# EAGLE design Switch Decoderv06 (EAGLE 8.4.3)
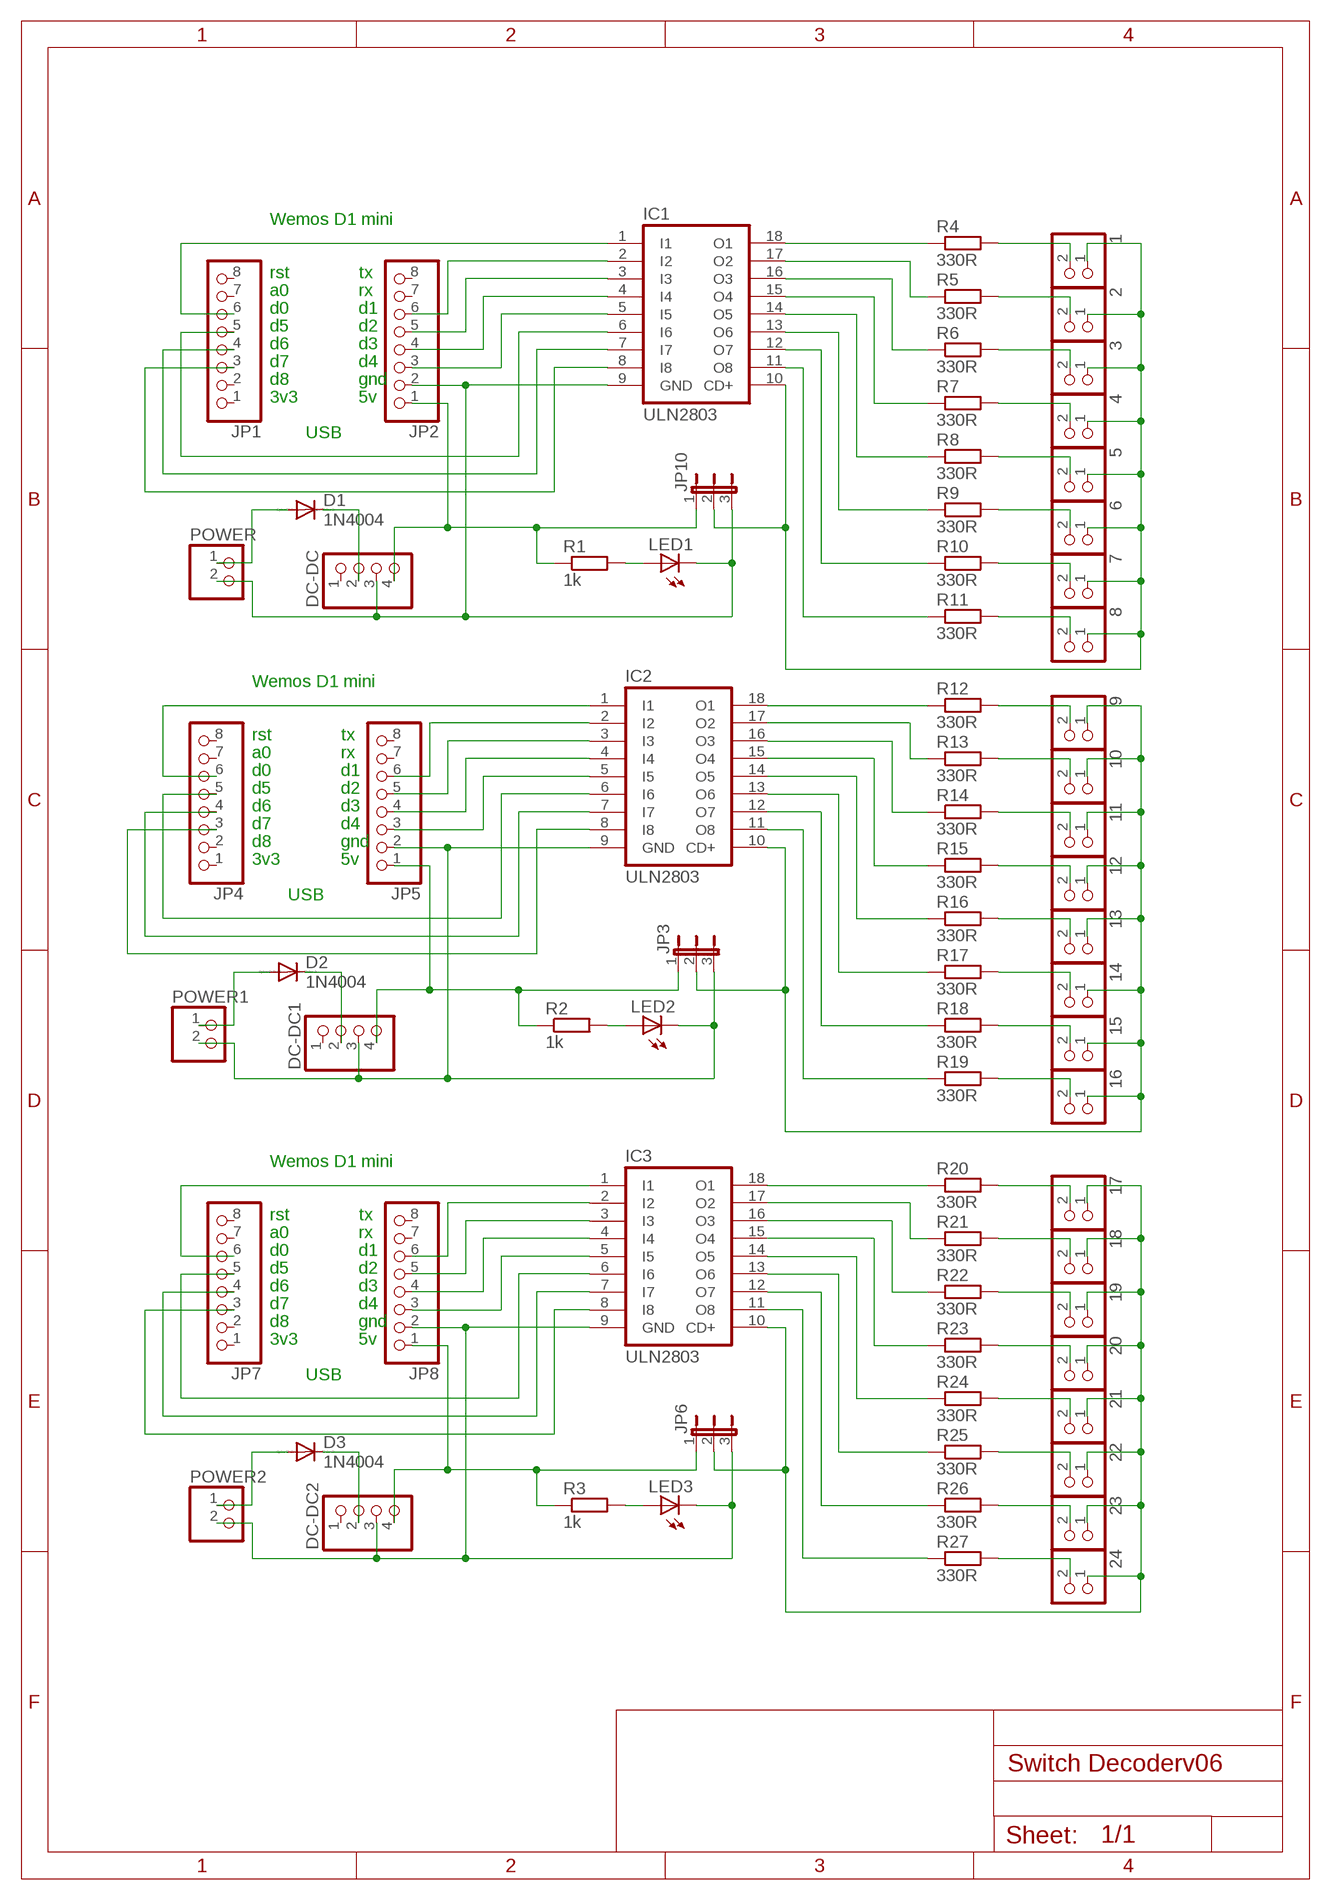
[diagram p0: schematic, sheet 1]

## Parts
1  PINHD-1X2  [1X02]
2  PINHD-1X2  [1X02]
3  PINHD-1X2  [1X02]
4  PINHD-1X2  [1X02]
5  PINHD-1X2  [1X02]
6  PINHD-1X2  [1X02]
7  PINHD-1X2  [1X02]
8  PINHD-1X2  [1X02]
9  PINHD-1X2  [1X02]
10  PINHD-1X2  [1X02]
11  PINHD-1X2  [1X02]
12  PINHD-1X2  [1X02]
13  PINHD-1X2  [1X02]
14  PINHD-1X2  [1X02]
15  PINHD-1X2  [1X02]
16  PINHD-1X2  [1X02]
17  PINHD-1X2  [1X02]
18  PINHD-1X2  [1X02]
19  PINHD-1X2  [1X02]
20  PINHD-1X2  [1X02]
21  PINHD-1X2  [1X02]
22  PINHD-1X2  [1X02]
23  PINHD-1X2  [1X02]
24  PINHD-1X2  [1X02]
D1  1N4004  [DO41-10]
D2  1N4004  [DO41-10]
D3  1N4004  [DO41-10]
DC-DC  PINHD-1X4  [1X04]
DC-DC1  PINHD-1X4  [1X04]
DC-DC2  PINHD-1X4  [1X04]
IC1  ULN2803  ULN2803A  [DIL18]
IC2  ULN2803  ULN2803A  [DIL18]
IC3  ULN2803  ULN2803A  [DIL18]
JP1  PINHD-1X8  [1X08]
JP2  PINHD-1X8  [1X08]
JP3  JP2E  [JP2]
JP4  PINHD-1X8  [1X08]
JP5  PINHD-1X8  [1X08]
JP6  JP2E  [JP2]
JP7  PINHD-1X8  [1X08]
JP8  PINHD-1X8  [1X08]
JP10  JP2E  [JP2]
LED1  LED3MM  [LED3MM]
LED2  LED3MM  [LED3MM]
LED3  LED3MM  [LED3MM]
POWER  PINHD-1X2  [1X02]
POWER1  PINHD-1X2  [1X02]
POWER2  PINHD-1X2  [1X02]
R1  1k  R-EU_0309/10  [0309/10]
R2  1k  R-EU_0309/10  [0309/10]
R3  1k  R-EU_0309/10  [0309/10]
R4  330R  R-EU_0207/7  [0207/7]
R5  330R  R-EU_0207/7  [0207/7]
R6  330R  R-EU_0207/7  [0207/7]
R7  330R  R-EU_0207/7  [0207/7]
R8  330R  R-EU_0207/7  [0207/7]
R9  330R  R-EU_0207/7  [0207/7]
R10  330R  R-EU_0207/7  [0207/7]
R11  330R  R-EU_0207/7  [0207/7]
R12  330R  R-EU_0207/7  [0207/7]
R13  330R  R-EU_0207/7  [0207/7]
R14  330R  R-EU_0207/7  [0207/7]
R15  330R  R-EU_0207/7  [0207/7]
R16  330R  R-EU_0207/7  [0207/7]
R17  330R  R-EU_0207/7  [0207/7]
R18  330R  R-EU_0207/7  [0207/7]
R19  330R  R-EU_0207/7  [0207/7]
R20  330R  R-EU_0207/7  [0207/7]
R21  330R  R-EU_0207/7  [0207/7]
R22  330R  R-EU_0207/7  [0207/7]
R23  330R  R-EU_0207/7  [0207/7]
R24  330R  R-EU_0207/7  [0207/7]
R25  330R  R-EU_0207/7  [0207/7]
R26  330R  R-EU_0207/7  [0207/7]
R27  330R  R-EU_0207/7  [0207/7]

## Nets
N$1 [Gnd]: DC-DC.3 IC1.9(GND) JP2.2 JP10.3 LED1.K(C) POWER.2
N$2: IC1.1(I1) JP1.6
N$3: IC1.7(I7) JP1.4
N$4 [5V]: D1.C DC-DC.2
N$5: IC1.6(I6) JP1.5
N$6: LED1.A R1.2
N$7: IC1.3(I3) JP2.5
N$8 [5V]: 1.1 2.1 3.1 4.1 5.1 6.1 7.1 8.1 IC1.10(CD+) JP10.2
N$9: IC1.5(I5) JP2.3
N$10: IC1.2(I2) JP2.6
N$11: IC1.8(I8) JP1.3
N$12: IC1.18(O1) R4.1
N$13: IC1.4(I4) JP2.4
N$14: IC2.1(I1) JP4.6
N$15 [Gnd]: 1.2 R4.2
N$16 [5V]: 9.1 10.1 11.1 12.1 13.1 14.1 15.1 16.1 IC2.10(CD+) JP3.2
N$17 [Gnd]: IC1.17(O2) R5.1
N$18 [Gnd]: 2.2 R5.2
N$19 [Gnd]: 3.2 R6.2
N$20 [Gnd]: IC1.16(O3) R6.1
N$21 [Gnd]: IC1.15(O4) R7.1
N$22 [Gnd]: 4.2 R7.2
N$23 [Gnd]: 5.2 R8.2
N$24 [Gnd]: IC1.14(O5) R8.1
N$25 [Gnd]: IC1.13(O6) R9.1
N$26 [Gnd]: 6.2 R9.2
N$27 [Gnd]: 7.2 R10.2
N$28 [Gnd]: IC1.12(O7) R10.1
N$29 [Gnd]: 8.2 R11.2
N$30: LED2.A R2.2
N$31: IC2.2(I2) JP5.6
N$32: IC2.3(I3) JP5.5
N$33: IC2.4(I4) JP5.4
N$34 [5V]: D2.A POWER1.1
N$35 [5V]: D2.C DC-DC1.2
N$36: IC2.5(I5) JP5.3
N$37: IC2.6(I6) JP4.5
N$38: IC2.7(I7) JP4.4
N$39: IC2.8(I8) JP4.3
N$40: IC3.18(O1) R20.1
N$41 [Gnd]: DC-DC1.3 IC2.9(GND) JP3.3 JP5.2 LED2.K(C) POWER1.2
N$42: IC1.11(O8) R11.1
N$43 [Gnd]: IC2.11(O8) R19.1
N$44: IC2.18(O1) R12.1
N$45 [Gnd]: IC2.17(O2) R13.1
N$46 [Gnd]: 9.2 R12.2
N$47 [5V]: D1.A POWER.1
N$48 [Gnd]: 10.2 R13.2
N$49 [Gnd]: IC2.16(O3) R14.1
N$50 [Gnd]: IC2.15(O4) R15.1
N$51 [Gnd]: 11.2 R14.2
N$52 [Gnd]: 12.2 R15.2
N$53 [Gnd]: IC2.14(O5) R16.1
N$54 [Gnd]: IC2.13(O6) R17.1
N$55 [Gnd]: 13.2 R16.2
N$56 [Gnd]: 14.2 R17.2
N$57 [Gnd]: IC2.12(O7) R18.1
N$58 [Gnd]: 15.2 R18.2
N$59: IC3.1(I1) JP7.6
N$60: LED3.A R3.2
N$61: IC3.2(I2) JP8.6
N$62: IC3.3(I3) JP8.5
N$63: IC3.4(I4) JP8.4
N$64 [5V]: D3.A POWER2.1
N$65 [5V]: D3.C DC-DC2.2
N$66: IC3.5(I5) JP8.3
N$67: IC3.6(I6) JP7.5
N$68: IC3.7(I7) JP7.4
N$69: IC3.8(I8) JP7.3
N$70 [5V]: 17.1 18.1 19.1 20.1 21.1 22.1 23.1 24.1 IC3.10(CD+) JP6.2
N$71 [Gnd]: DC-DC2.3 IC3.9(GND) JP6.3 JP8.2 LED3.K(C) POWER2.2
N$72 [Gnd]: 16.2 R19.2
N$73 [Gnd]: IC3.11(O8) R27.1
N$74 [5V]: DC-DC.4 JP2.1 JP10.1 R1.1
N$75 [Gnd]: IC3.17(O2) R21.1
N$76 [5V]: DC-DC1.4 JP3.1 JP5.1 R2.1
N$77 [5V]: DC-DC2.4 JP6.1 JP8.1 R3.1
N$78 [Gnd]: IC3.16(O3) R22.1
N$79 [Gnd]: IC3.15(O4) R23.1
N$81 [Gnd]: 17.2 R20.2
N$82 [Gnd]: IC3.14(O5) R24.1
N$83 [Gnd]: IC3.13(O6) R25.1
N$84 [Gnd]: 18.2 R21.2
N$85 [Gnd]: 19.2 R22.2
N$86 [Gnd]: IC3.12(O7) R26.1
N$87 [Gnd]: 20.2 R23.2
N$88 [Gnd]: 21.2 R24.2
N$89 [Gnd]: 22.2 R25.2
N$90 [extra]: 23.2 R26.2
N$91 [Gnd]: 24.2 R27.2
Unconnected: DC-DC1.1 DC-DC2.1 DC-DC.1 JP1.1 JP1.2 JP1.7 JP1.8 JP2.7 JP2.8 JP4.1 JP4.2 JP4.7 JP4.8 JP5.7 JP5.8 JP7.1 JP7.2 JP7.7 JP7.8 JP8.7 JP8.8

## Notes on the sheet
- Wemos D1 mini
- rst | tx
- a0 | rx
- d0 | d1
- d5 | d2
- d6 | d3
- d7 | d4
- d8 | gnd
- 3v3 | 5v
- USB
- Wemos D1 mini
- rst | tx
- a0 | rx
- d0 | d1
- d5 | d2
- d6 | d3
- d7 | d4
- d8 | gnd
- 3v3 | 5v
- USB
- Wemos D1 mini
- rst | tx
- a0 | rx
- d0 | d1
- d5 | d2
- d6 | d3
- d7 | d4
- d8 | gnd
- 3v3 | 5v
- USB

## Library data of the parts
1-24 POWER POWER1 POWER2 = pinhead:PINHD-1X2: PIN HEADER
D1-D3 = diode:1N4004: DIODE general purpose rectifier, 1 A
DC-DC DC-DC1 DC-DC2 = pinhead:PINHD-1X4: PIN HEADER
IC1-IC3 = uln-udn:ULN2803A: DRIVER ARRAY
JP1 JP2 JP4 JP5 JP7 JP8 = pinhead:PINHD-1X8: PIN HEADER
JP3 JP6 JP10 = jumper:JP2E: JUMPER
LED1-LED3 = led:LED: LED OSRAM: - CHIPLED LG R971, LG N971, LY N971, LG Q971, LY Q971, LO R971, LY R971 LH N974, LH R974 LS Q976, LO Q976, LY Q976 LO Q996 - Hyper CHIPLED LW Q18S LB Q993, LB Q99A, LB R99A - SideLED LS A670, LO A670, LY A670, LG A670, LP A670 LB A673, LV A673, LT A673, LW A673 LH A674 LY A675 LS A676, LA A676, LO A676, LY A676, LW A676 LS A679, LY A679, LG A679 - Hyper Micro SIDELED® LS Y876, LA Y876, LO Y876, LY Y876 LT Y87S - SmartLED LW L88C, LW L88S LB L89C, LB L89S, LG L890 LS L89K, LO L89K, LY L89K LS L896, LA L896, LO L896, LY L896 - TOPLED LS T670, LO T670, LY T670, LG T670, LP T670 LSG T670, LSP T670, LSY T670, LOP T670, LYG T670 LG T671, LOG T671, LSG T671 LB T673, LV T673, LT T673, LW T673 LH T674 LS T676, LA T676, LO T676, LY T676, LB T676, LH T676, LSB T676, LW T676 LB T67C, LV T67C, LT T67C, LS T67K, LO T67K, LY T67K, LW E67C LS E67B, LA E67B, LO E67B, LY E67B, LB E67C, LV E67C, LT E67C LW T67C LS T679, LY T679, LG T679 LS T770, LO T770, LY T770, LG T770, LP T770 LB T773, LV T773, LT T773, LW T773 LH T774 LS E675, LA E675, LY E675, LS T675 LS T776, LA T776, LO T776, LY T776, LB T776 LHGB T686 LT T68C, LB T68C - Hyper Mini TOPLED® LB M676 - Mini TOPLED Santana® LG M470 LS M47K, LO M47K, LY M47K Source: http://www.osram.convergy.de LUXEON: - LUMILED® LXK2-PW12-R00, LXK2-PW12-S00, LXK2-PW14-U00, LXK2-PW14-V00 LXK2-PM12-R00, LXK2-PM12-S00, LXK2-PM14-U00 LXK2-PE12-Q00, LXK2-PE12-R00, LXK2-PE12-S00, LXK2-PE14-T00, LXK2-PE14-U00 LXK2-PB12-K00, LXK2-PB12-L00, LXK2-PB12-M00, LXK2-PB14-N00, LXK2-PB14-P00, LXK2-PB14-Q00 LXK2-PR12-L00, LXK2-PR12-M00, LXK2-PR14-Q00, LXK2-PR14-R00 LXK2-PD12-Q00, LXK2-PD12-R00, LXK2-PD12-S00 LXK2-PH12-R00, LXK2-PH12-S00 LXK2-PL12-P00, LXK2-PL12-Q00, LXK2-PL12-R00 Source: www.luxeon.com KINGBRIGHT: KA-3528ASYC Source: www.kingbright.com
R1-R27 = resistor:R-EU_: RESISTOR, European symbol

## Net classes
0 default: width 0.508 mm, clearance 0.254 mm
1 5V: width 0.762 mm, clearance 0.254 mm
2 Gnd: width 0.762 mm, clearance 0.254 mm
3 extra: width 0.508 mm, clearance 0.254 mm
4 3.3V: width 0.508 mm, clearance 0.254 mm

## Board
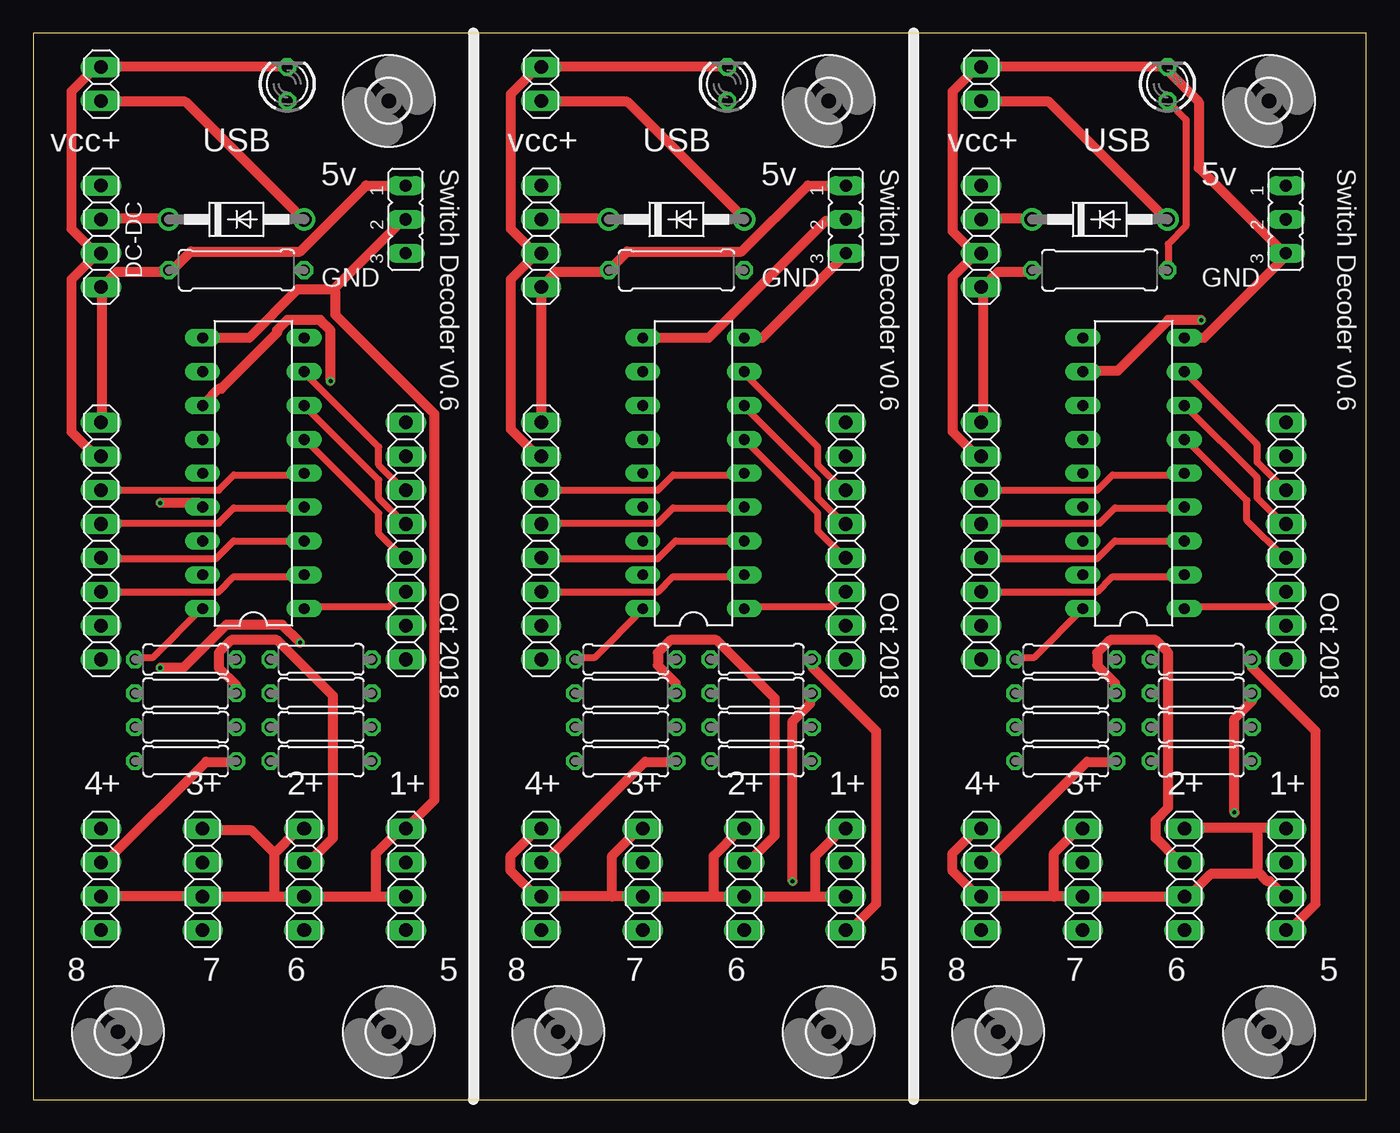
[diagram p1: board, top side]
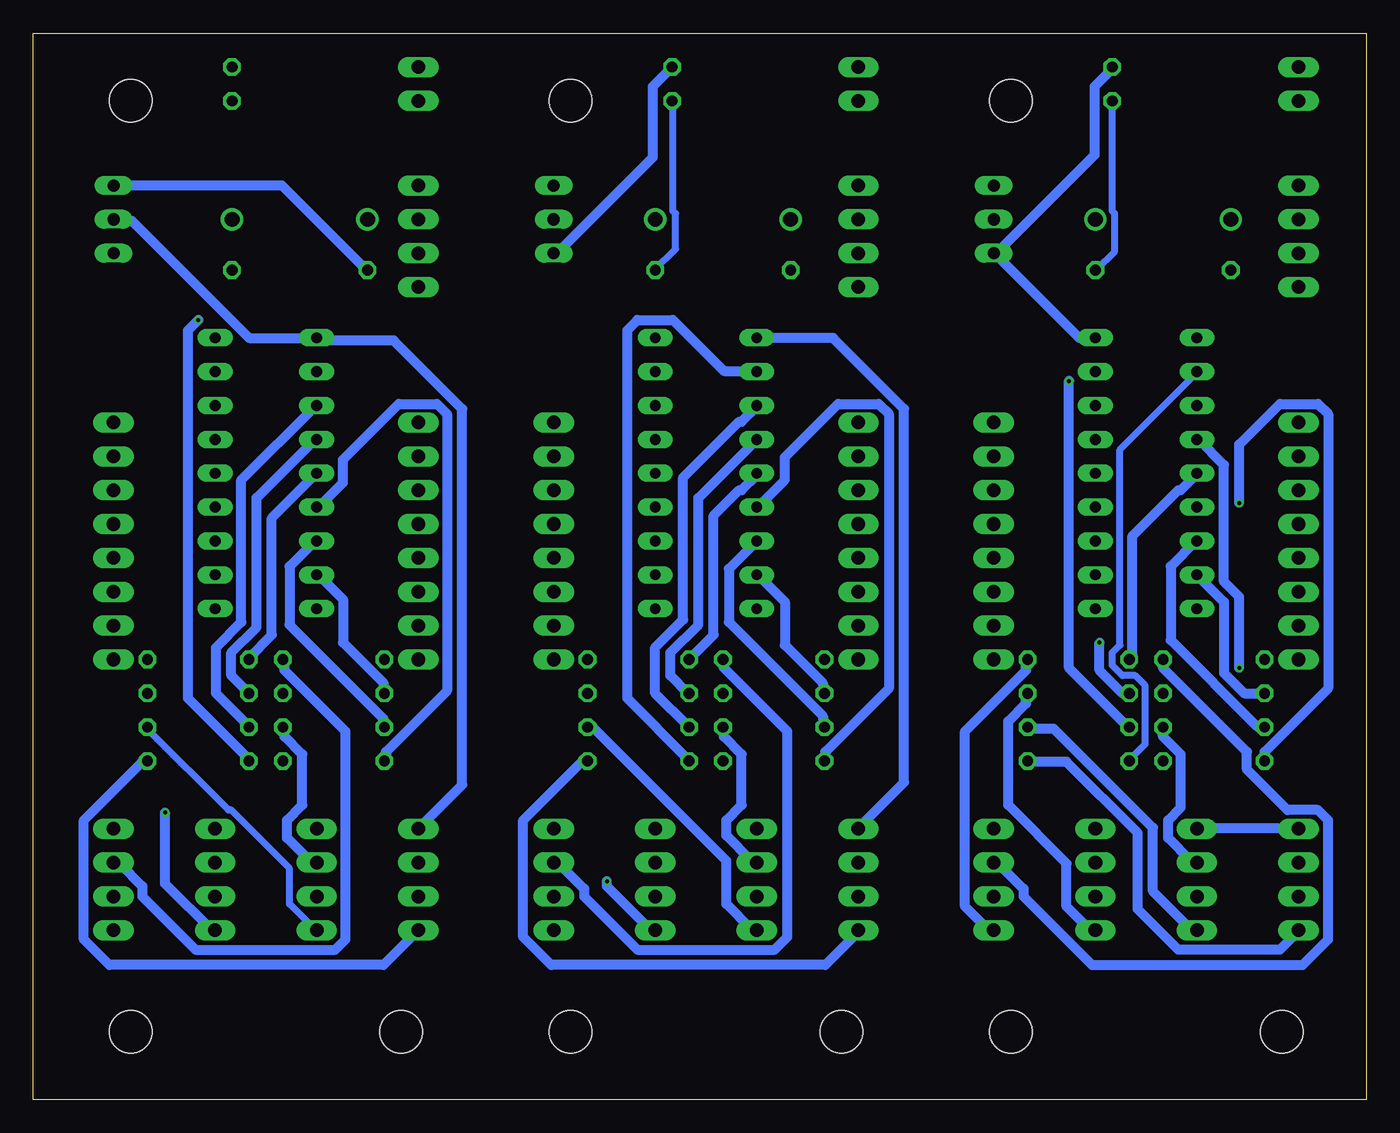
[diagram p2: board, bottom side, seen from below]

Size 100 x 80 mm. Coordinates in mm from the lower left corner, seen from the top.
Outline: 0,0 100,0 100,80 0,80 0,0
Copper layers (1*16): Top 0.035mm / dielectric 1.5mm / Bottom 0.035mm
Design rules "NOA Eagle Rule 2016-06-12": minimum track width 6mil, minimum drill 0.3mm, track to track 6mil, track to pad 6mil, pad to pad 6mil, via to via 6mil, smd to smd 0mil, copper to edge 0.4mm, drill to drill 10mil, minimum pad ring 10mil, minimum via ring 6mil, stop-mask expansion 2mil, vias tented up to drill 25mil, thermal gap 10mil
tRestrict: 2 lines
bRestrict: 2 lines

### Footprints (pad centres in the part's own frame; a part is rotated, then mirrored left to right if it is on the bottom)
1X02 = drill 1.016 long: 1 -1.27,0; 2 1.27,0
DO41-10 = drill 1.118: A 5.08,0; C -5.08,0
1X04 = drill 1.016 long: 1 -3.81,0; 2 -1.27,0; 3 1.27,0; 4 3.81,0
DIL18 = drill 0.813 long: 1 -10.16,-3.81; 2 -7.62,-3.81; 3 -5.08,-3.81; 4 -2.54,-3.81; 5 0,-3.81; 6 2.54,-3.81; 7 5.08,-3.81; 8 7.62,-3.81; 9 10.16,-3.81; 10 10.16,3.81; 11 7.62,3.81; 12 5.08,3.81; 13 2.54,3.81; 14 0,3.81; 15 -2.54,3.81; 16 -5.08,3.81; 17 -7.62,3.81; 18 -10.16,3.81
1X08 = drill 1.016 long: 1 -8.89,0; 2 -6.35,0; 3 -3.81,0; 4 -1.27,0; 5 1.27,0; 6 3.81,0; 7 6.35,0; 8 8.89,0
JP2 = drill 0.914 long: 1 -2.54,0; 2 0,0; 3 2.54,0
LED3MM = drill 0.813 octagon: A -1.27,0; K 1.27,0
0309/10 = drill 0.813 octagon: 1 -5.08,0; 2 5.08,0
0207/7 = drill 0.813 octagon: 1 -3.81,0; 2 3.81,0
3,2 = hole 3.2: 0,0

### Placement (x,y rotation side)
1  27.94,19.05 270 top
2  20.32,19.05 270 top
3  12.7,19.05 270 top
4  5.08,19.05 270 top
5  27.94,13.97 270 top
6  20.32,13.97 270 top
7  12.7,13.97 270 top
8  5.08,13.97 270 top
9  60.96,19.05 270 top
10  53.34,19.05 270 top
11  45.72,19.05 270 top
12  38.1,19.05 270 top
13  60.96,13.97 270 top
14  53.34,13.97 270 top
15  45.72,13.97 270 top
16  38.1,13.97 270 top
17  93.98,19.05 270 top
18  86.36,19.05 270 top
19  78.74,19.05 270 top
20  71.12,19.05 270 top
21  93.98,13.97 270 top
22  86.36,13.97 270 top
23  78.74,13.97 270 top
24  71.12,13.97 270 top
D1  15.24,66.04 0 top
D2  48.26,66.04 0 top
D3  80.01,66.04 0 top
DC-DC  5.08,64.77 270 top
DC-DC1  38.1,64.77 270 top
DC-DC2  71.12,64.77 270 top
IC1  16.51,46.99 90 top
IC2  49.53,46.99 90 top
IC3  82.55,46.99 90 top
JP1  27.94,41.91 270 top
JP2  5.08,41.91 270 top
JP3  60.96,66.04 270 top
JP4  60.96,41.91 270 top
JP5  38.1,41.91 270 top
JP6  93.98,66.04 270 top
JP7  93.98,41.91 270 top
JP8  71.12,41.91 270 top
JP10  27.94,66.04 270 top
LED1  19.05,76.2 90 top
LED2  52.07,76.2 90 top
LED3  85.09,76.2 90 top
POWER  5.08,76.2 90 top
POWER1  38.1,76.2 90 top
POWER2  71.12,76.2 90 top
R1  15.24,62.23 0 top
R2  48.26,62.23 0 top
R3  80.01,62.23 0 top
R4  11.43,33.02 0 top
R5  11.43,30.48 0 top
R6  11.43,27.94 0 top
R7  11.43,25.4 0 top
R8  21.59,33.02 0 top
R9  21.59,30.48 0 top
R10  21.59,27.94 0 top
R11  21.59,25.4 0 top
R12  44.45,33.02 0 top
R13  44.45,30.48 0 top
R14  44.45,27.94 0 top
R15  44.45,25.4 0 top
R16  54.61,33.02 0 top
R17  54.61,30.48 0 top
R18  54.61,27.94 0 top
R19  54.61,25.4 0 top
R20  77.47,33.02 0 top
R21  77.47,30.48 0 top
R22  77.47,27.94 0 top
R23  77.47,25.4 0 top
R24  87.63,33.02 0 top
R25  87.63,30.48 0 top
R26  87.63,27.94 0 top
R27  87.63,25.4 0 top
U$1  [3,2]  26.67,74.93 0 top
U$2  [3,2]  59.69,74.93 0 top
U$3  [3,2]  6.35,5.08 0 top
U$4  [3,2]  26.67,5.08 0 top
U$5  [3,2]  92.71,74.93 0 top
U$6  [3,2]  39.37,5.08 0 top
U$7  [3,2]  59.69,5.08 0 top
U$8  [3,2]  72.39,5.08 0 top
U$9  [3,2]  92.71,5.08 0 top

### Tracks (layer width: path | path; a pad name or v marks a point on that pad's centre or on a via)
N$1
  Top 0.762: JP2.2 4.95,48.39 4.57,48.39 2.86,50.1 2.86,61.53 4.95,63.63 DC-DC.3 4.57,63.63 2.86,65.34 2.86,75.63 4.76,77.53 POWER.2 5.14,77.53 19.05,77.53 LED1.K
  Bottom 0.762: IC1.9 21.53,57.15 27.81,63.44 JP10.3 27.62,63.63 20.38,70.87 20.38,76.01 19.05,77.34 LED1.K
N$2
  Top 0.508: IC1.1 20.38,36.96 26.67,36.96 27.81,38.1 JP1.6
N$3
  Top 0.508: IC1.7 25.91,46.48 25.91,45.15 27.81,43.24 JP1.4
N$4
  Top 0.762: DC-DC.2 5.14,66.1 10.1,66.1 D1.C
N$5
  Top 0.508: IC1.6 20.38,49.53 25.91,44.01 25.91,42.48 27.81,40.58 JP1.5
N$6
  Bottom 0.508: LED1.A 19.05,66.67 18.86,66.48 18.86,63.63 20.19,62.29 R1.2
N$7
  Top 0.508: IC1.3 15.05,41.91 13.72,40.58 5.14,40.58 JP2.5
N$8
  Top 0.762: IC1.10 16.19,57.15 19.81,60.77 22.48,60.77 | 22.48,60.77 27.81,66.1 JP10.2 | 8.1 7.1 18.1,15.24 | 18.1,15.24 6.1 25.72,15.24 | 25.72,15.24 5.1 | 18.1,18.48 19.81,20.19 20.19,20.19 2.1 | 18.1,15.24 18.1,18.48 | 25.72,15.24 25.72,18.48 27.43,20.19 27.81,20.19 1.1 30.1,22.48 30.1,51.44 22.67,58.86 22.67,60.58 22.48,60.77 | 18.1,18.48 16.38,20.19 12.76,20.19 3.1
  Bottom 0.762: 4.1 5.14,20.38 12.57,20.38 3.1
N$9
  Top 0.508: JP2.3 13.91,45.72 15.05,46.86 20.19,46.86 IC1.5
N$10
  Top 0.508: JP2.6 13.91,38.1 15.05,39.24 20.19,39.24 IC1.2
N$11
  Top 0.508: IC1.8 20.38,54.48 25.91,48.96 25.91,47.62 27.81,45.72 JP1.3
N$12
  Top 0.508: R4.1 7.62,33.15 8.95,33.15 12.57,36.77 IC1.18
N$13
  Top 0.508: IC1.4 20.19,44.39 15.05,44.39 13.91,43.24 5.14,43.24 JP2.4
N$14
  Top 0.508: JP4.6 59.82,36.96 53.34,36.96 IC2.1
N$15
  Bottom 0.762: R4.2 15.24,32.38 8.95,26.1 8.95,24.77 5.91,21.72 3.62,21.72 2.86,20.95 2.86,12 4.76,10.1 20.57,10.1 25.72,15.24 25.72,15.81 27.81,17.91 1.2
N$16
  Top 0.762: IC2.10 50.67,57.15 59.44,65.91 60.96,65.91 JP3.2 | 43.43,15.24 15.1 51.05,15.24 | 43.43,15.24 16.1 37.91,15.05 35.81,17.14 35.81,18.29 37.72,20.19 38.1,20.19 12.1 | 51.05,15.24 14.1 58.67,15.24 | 43.43,15.24 43.43,18.29 45.34,20.19 45.72,20.19 11.1 | 51.05,15.24 51.05,18.29 52.96,20.19 53.34,20.19 10.1 | 58.67,15.24 13.1 | 58.67,15.24 58.67,18.29 60.58,20.19 60.96,20.19 9.1
  Bottom 0.762: IC2.10 40.01,57.15 34.67,51.82 34.67,23.81 38.1,20.38 12.1
N$17
  Bottom 0.762: R5.1 9.14,30.48 10.67,32 10.67,37.34 IC1.17
N$18
  Top 0.762: R5.2 15.24,31.05 13.91,32.38 13.91,33.53 14.86,34.48 18.29,34.48 22.48,30.29 22.48,19.62 20.77,17.91 20.38,17.91 2.2
N$19
  Bottom 0.762: R6.2 15.24,27.24 13.91,25.91 13.91,21.91 14.86,20.95 14.86,19.62 13.14,17.91 12.76,17.91 3.2
N$20
  Bottom 0.762: R6.1 7.62,28 8.19,28 14.67,34.48 14.67,40.01 12.76,41.91 IC1.16
N$21  (via drill 0.3)
  Top 0.762: v9.53,44.77 12.38,44.77 IC1.15
  Bottom 0.762: R7.1 7.62,26.1 2.86,30.86 2.86,51.44 3.62,52.2 6.48,52.2 9.53,49.15 v9.53,44.77
N$22
  Top 0.762: R7.2 15.24,25.34 12.95,25.34 5.52,17.91 5.14,17.91 4.2
N$23
  Bottom 0.762: R8.2 25.53,32.96 25.53,32.19 30.1,27.62 30.1,14.48 28.38,12.76 28,12.76 5.2
N$24
  Bottom 0.762: IC1.14 12.76,46.86 13.91,45.72 14.1,45.72 17.53,42.29 17.53,33.34 17.72,33.15 R8.1
N$25  (via drill 0.3)
  Top 0.762: v9.53,32.38 11.24,32.38 14.48,35.62 18.67,35.62 v20,34.29
  Bottom 0.762: v9.53,32.38 9.53,37.72 10.67,38.86 10.67,47.62 12.57,49.53 IC1.13 | v20,34.29 20,32.19 18.29,30.48 R9.1
N$26
  Bottom 0.762: R9.2 25.53,30.48 25.53,29.72 26.86,28.38 26.86,22.1 22.48,17.72 22.48,14.48 20.77,12.76 20.38,12.76 6.2
N$27
  Bottom 0.762: R10.2 25.34,27.81 23.43,27.81 16,20.38 16,15.62 13.14,12.76 12.76,12.76 7.2
N$28  (via drill 0.3)
  Top 0.762: v22.29,53.91 22.29,57.72 21.53,58.48 19.05,58.48 18.29,57.72 18.29,57.53 14.1,53.34 13.91,53.34 12.76,52.2 IC1.12
  Bottom 0.762: v22.29,53.91 22.29,32.38 17.91,28 R10.1
N$29
  Bottom 0.762: R11.2 25.34,25.34 22.48,25.34 17.14,20 17.14,14.29 14.1,11.24 6.48,11.24 5.14,12.57 8.2
N$30
  Bottom 0.508: LED2.A 52.01,74.87 52.01,66.67 51.82,66.48 51.82,63.82 53.34,62.29 R2.2
N$31
  Top 0.508: JP5.6 46.86,38.1 48.01,39.24 53.34,39.24 IC2.2
N$32
  Top 0.508: IC2.3 48.2,41.91 46.86,40.58 38.1,40.58 JP5.5
N$33
  Top 0.508: IC2.4 53.34,44.39 48.01,44.39 46.86,43.24 38.1,43.24 JP5.4
N$34
  Top 0.762: POWER1.1 38.1,74.87 44.58,74.87 53.34,66.1 D2.A
N$35
  Top 0.762: DC-DC1.2 38.1,66.1 43.05,66.1 D2.C
N$36
  Top 0.508: JP5.3 46.86,45.72 48.01,46.86 53.34,46.86 IC2.5
N$37
  Top 0.508: IC2.6 58.86,44.01 58.86,42.67 60.96,40.58 JP4.5
N$38
  Top 0.508: IC2.7 53.34,52.01 58.86,46.48 58.86,45.15 60.96,43.05 JP4.4
N$39
  Top 0.508: JP4.3 60.77,45.72 58.86,47.62 58.86,48.96 53.34,54.48 IC2.8
N$40
  Top 0.508: IC3.18 75.06,33.15 73.72,33.15 R20.1
N$41
  Top 0.762: JP5.2 38.1,48.39 37.72,48.39 35.81,50.29 35.81,61.53 37.72,63.44 38.1,63.44 DC-DC1.3 37.53,63.63 35.81,65.34 35.81,75.44 37.91,77.53 POWER1.2 38.1,77.53 52.01,77.53 LED2.K | IC2.9 54.67,57.15 60.96,63.44 JP3.3
  Bottom 0.762: LED2.K 53.53,76.01 53.53,70.67 60.58,63.63 60.96,63.63 JP3.3
N$42
  Bottom 0.508: IC1.11 12.76,54.48 18.48,48.77 18.48,34.1 19.05,33.53 19.05,32.58 18.29,31.81 17.34,31.81 16.57,31.05 16.57,26.67 17.72,25.53 R11.1
N$43
  Bottom 0.762: IC2.11 45.72,54.67 48.2,54.67 52.01,58.48 54.67,58.48 55.44,57.72 55.44,30.1 50.86,25.53 R19.1
N$44
  Top 0.508: R12.1 40.77,33.15 42.1,33.15 45.72,36.77 IC2.18
N$45
  Bottom 0.762: R13.1 40.77,30.48 40.77,31.24 43.62,34.1 43.62,37.34 45.72,39.43 IC2.17
N$46
  Bottom 0.762: R12.2 48.2,32.96 48.2,32.38 43.43,27.62 43.43,12.19 44.39,11.24 54.67,11.24 58.67,15.24 58.67,15.81 60.58,17.72 60.96,17.72 9.2
N$47
  Top 0.762: POWER.1 5.14,74.87 11.43,74.87 20.19,66.1 D1.A
N$48
  Top 0.762: R13.2 48.2,30.48 48.2,31.24 46.86,32.58 46.86,33.53 47.82,34.48 51.24,34.48 55.63,30.1 55.63,19.81 53.72,17.91 53.34,17.91 10.2
N$49
  Bottom 0.762: IC2.16 47.82,39.81 47.82,35.81 40.77,28.77 40.77,28 R14.1
N$50
  Bottom 0.762: R15.1 40.58,25.53 40.58,26.1 35.81,30.86 35.81,51.44 36.58,52.2 39.62,52.2 43.62,48.2 43.62,46.48 45.72,44.39 IC2.15
N$51
  Bottom 0.762: R14.2 48.2,27.81 48.2,27.24 46.86,25.91 46.86,22.1 48.01,20.95 48.01,19.81 46.1,17.91 45.72,17.91 11.2
N$52
  Top 0.762: R15.2 48.2,25.34 45.91,25.34 38.48,17.91 38.1,17.91 12.2
N$53
  Bottom 0.762: R16.1 48.96,34.86 48.96,43.81 47.05,45.72 46.86,45.72 45.72,46.86 IC2.14
N$54
  Bottom 0.762: IC2.13 50.1,45.15 50.1,35.62 52.2,33.53 52.2,31.81 50.86,30.48 R17.1
N$55
  Top 0.762: R16.2 58.48,32.96 58.48,32.38 63.25,27.62 63.25,14.67 61.34,12.76 60.96,12.76 13.2
N$56  (via drill 0.3)
  Top 0.762: v56.96,16.38 56.96,28.38 58.29,29.72 58.29,30.48 R17.2
  Bottom 0.762: v56.96,16.38 56.96,16 53.72,12.76 53.34,12.76 14.2
N$57
  Bottom 0.762: R18.1 53.34,30.48 53.34,33.91 51.24,36.01 51.24,46.67 47.05,50.86 46.86,50.86 45.72,52.01 IC2.12
N$58
  Bottom 0.762: R18.2 58.29,27.81 57.91,27.81 48.01,17.91 48.01,14.67 46.1,12.76 45.72,12.76 15.2
N$59
  Top 0.508: IC3.1 86.49,36.96 92.77,36.96 93.92,38.1 JP7.6
N$60
  Top 0.508: LED3.A 86.49,73.53 86.49,65.53 85.15,64.2 85.15,62.29 R3.2
N$61
  Top 0.508: JP8.6 79.82,38.1 80.96,39.24 86.3,39.24 IC3.2
N$62
  Top 0.508: IC3.3 81.15,41.91 79.82,40.58 71.25,40.58 JP8.5
N$63
  Top 0.508: IC3.4 86.3,44.39 81.15,44.39 80.01,43.24 71.25,43.24 JP8.4
N$64
  Top 0.762: POWER2.1 71.25,74.87 76.2,74.87 84.96,66.1 D3.A
N$65
  Top 0.762: DC-DC2.2 71.25,66.1 74.87,66.1 D3.C
N$66
  Top 0.508: JP8.3 79.82,45.72 80.96,46.86 86.3,46.86 IC3.5
N$67
  Top 0.508: IC3.6 86.49,49.53 91.06,44.96 91.06,43.43 93.92,40.58 JP7.5
N$68
  Top 0.508: IC3.7 86.49,52.01 91.82,46.67 91.82,45.15 93.92,43.05 JP7.4
N$69
  Top 0.508: IC3.8 91.82,49.15 91.82,47.82 93.92,45.72 JP7.3
N$70
  Top 0.762: 91.82,20.38 93.92,20.38 17.1 | 91.82,20.38 86.49,20.38 18.1 | 91.82,17.14 92.58,16.38 92.77,16.38 93.92,15.24 21.1 | 91.82,20.38 91.82,17.14 | 76.58,15.24 23.1 22.1 86.68,15.24 88.39,16.95 91.63,16.95 91.82,17.14 | 76.58,15.24 24.1 70.87,15.24 68.96,17.14 68.96,18.48 70.67,20.19 71.06,20.19 20.1 | 76.58,15.24 76.58,18.48 78.3,20.19 78.68,20.19 19.1
  Bottom 0.762: JP6.2 93.92,65.91 92.58,65.91 83.82,57.15 IC3.10 78.49,56.96 72.96,56.96 67.82,51.82 67.82,23.62 20.1
N$71
  Top 0.762: JP8.2 71.06,48.39 70.67,48.39 68.96,50.1 68.96,61.72 70.67,63.44 71.06,63.44 DC-DC2.3 70.48,63.63 68.96,65.15 68.96,75.63 70.87,77.53 POWER2.2 71.25,77.53 84.96,77.53 LED3.K 85.15,77.15 87.44,74.87 87.44,69.91 93.73,63.63 JP6.3 94.11,63.44 87.82,57.15 IC3.9
N$72
  Bottom 0.762: R19.2 58.48,25.34 58.86,25.34 63.25,20.95 63.25,12.19 61.15,10.1 40.58,10.1 38.1,12.57 16.2
N$73  (via drill 0.3)
  Top 0.762: v87.63,58.48 85.15,58.48 81.34,54.67 78.87,54.67 IC3.11
  Bottom 0.762: v87.63,58.48 88.39,57.72 88.39,30.1 83.82,25.53 R27.1
N$74
  Top 0.762: JP10.1 24.96,68.58 20,63.63 11.81,63.63 10.48,62.29 R1.1 10.1,62.1 6.29,62.1 5.14,60.96 DC-DC.4 5.14,60.77 5.14,50.86 JP2.1
N$75
  Bottom 0.762: R21.1 73.72,30.48 73.72,31.24 76.77,34.29 76.77,37.53 78.68,39.43 IC3.17
N$76
  Top 0.762: JP3.1 58.1,68.58 53.15,63.63 44.58,63.63 R2.1 43.05,62.1 39.24,62.1 DC-DC1.4 JP5.1
N$77
  Top 0.762: R3.1 74.87,62.1 72.39,62.1 71.25,60.96 DC-DC2.4 71.25,60.77 71.25,50.86 JP8.1
  Bottom 0.762: JP6.1 81.34,68.58 75.06,62.29 R3.1
N$78
  Bottom 0.762: R22.1 73.72,28 73.72,28.57 80.77,35.62 80.77,40.01 78.87,41.91 IC3.16
N$79
  Bottom 0.762: R23.1 73.53,25.53 73.53,26.1 68.96,30.67 68.96,51.44 69.72,52.2 72.58,52.2 76.77,48.01 76.77,46.29 78.68,44.39 IC3.15
N$81
  Bottom 0.762: R20.2 81.15,32.96 81.15,32.19 76.58,27.62 76.58,12 77.34,11.24 87.82,11.24 91.82,15.24 91.82,16 93.53,17.72 93.92,17.72 17.2
N$82
  Bottom 0.762: IC3.14 82.11,43.62 82.11,34.86 83.82,33.15 R24.1
N$83
  Bottom 0.762: R25.1 85.15,31.81 85.15,33.53 83.25,35.43 83.25,45.15 78.87,49.53 IC3.13
N$84
  Top 0.762: R21.2 81.15,30.48 81.15,31.24 79.82,32.58 79.82,33.53 80.77,34.48 84.2,34.48 85.15,33.53 85.15,21.91 84.2,20.95 84.2,19.62 85.92,17.91 86.3,17.91 18.2
N$85
  Bottom 0.762: R22.2 81.15,27.81 81.15,27.24 79.82,25.91 79.82,22.1 80.96,20.95 80.96,19.62 79.25,17.91 78.87,17.91 19.2
N$86
  Bottom 0.762: IC3.12 78.87,52.01 84.39,46.48 84.39,35.81 86.3,33.91 86.3,30.48 83.82,28 R26.1
N$87
  Top 0.762: R23.2 81.15,25.34 79.06,25.34 71.63,17.91 71.25,17.91 20.2
N$88
  Top 0.762: R24.2 91.44,32.38 96.2,27.62 96.2,14.67 94.11,12.57 21.2
N$89  (via drill 0.3)
  Top 0.762: R25.2 91.44,29.91 90.11,28.57 v90.11,21.53
  Bottom 0.762: v90.11,21.53 90.11,16.19 86.49,12.57 22.2
N$90
  Bottom 0.508: R26.2 91.44,27.81 85.34,21.72 85.15,21.72 80.77,17.34 80.77,14.67 78.87,12.76 23.2
N$91
  Bottom 0.762: 24.2 73.72,10.1 94.3,10.1 96.2,12 96.2,20.95 91.82,25.34 91.44,25.34 R27.2

### Text on the board
tNames: vcc+ | USB | vcc+ | USB | vcc+ | USB | Switch Decoder v0.6 | Switch Decoder v0.6 | Switch Decoder v0.6 | 5v | 5v | 5v | GND | GND | GND | Oct 2018 | Oct 2018 | Oct 2018 | 4 | + | 3 | + | 2 | + | 1 | + | 4 | + | 3 | + | 2 | + | 1 | + | 4 | + | 3 | + | 2 | + | 1 | + | 8 | 7 | 6 | 5 | 8 | 7 | 6 | 5 | 8 | 7 | 6 | 5